# Altium schematic sheet 贴锁按键板201106.SchDoc
size A4
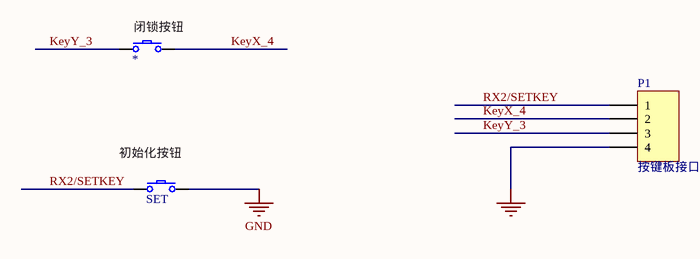
[diagram p0: 贴锁按键板201106.SchDoc]

## Parts
*  SW  [SW3]  (value not drawn)
P1  按键板接口  [4P-1.25_1]
SET  SW  [SW3]  (value not drawn)

## Nets
GND: P1.4 SET.2
KeyX_4: *.2 P1.2
KeyY_3: *.1 P1.3
RX2/SETKEY: P1.1 SET.1

## Notes on the sheet
- (near *) 闭锁按钮
- (near SET) 初始化按钮

## Library data of the parts
* SET = SW: Switch
P1 = Header 4_1: Header, 4-Pin; LatestRevisionDate: 17-Jul-2002; LatestRevisionNote: Re-released for DXP Platform.; Publisher: Altium Limited